# EAGLE design ControlBoardV1 (EAGLE 9.5.2)
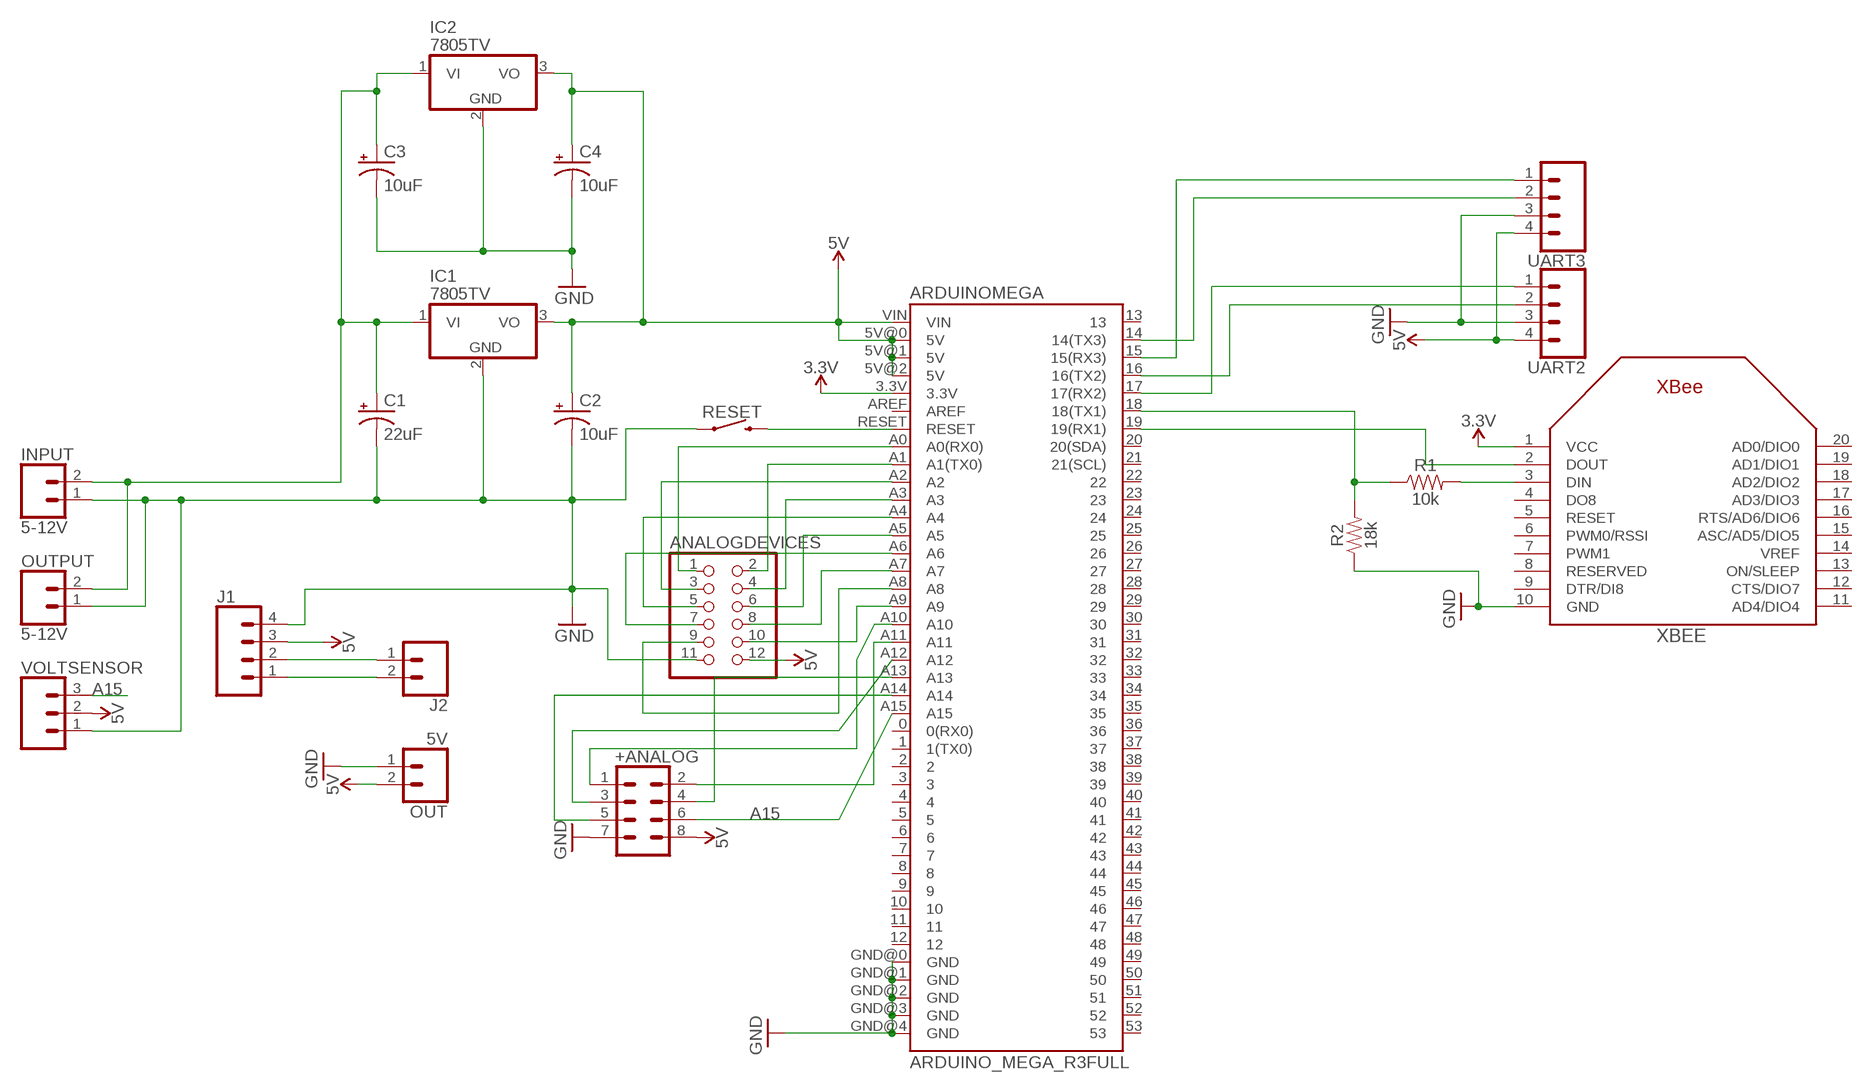
[diagram p0: schematic, sheet 1]

## Parts
+ANALOG  CONN_04X2  [2X4]
ANALOGDEVICES  PINHD-2X6  [2X06]
ARDUINOMEGA  ARDUINO_MEGA_R3FULL  [ARDUINO_MEGA]
C1  22uF  CPOL-USE2.5-5  [E2,5-5]
C2  10uF  CPOL-USE2.5-5  [E2,5-5]
C3  10uF  CPOL-USE2.5-5  [E2,5-5]
C4  10uF  CPOL-USE2.5-5  [E2,5-5]
IC1  7805TV  [TO220V]
IC2  7805TV  [TO220V]
INPUT  5-12V  CONN_023.5MM  [SCREWTERMINAL-3.5MM-2]
J1  CONN_04  [1X04]
J2  CONN_02  [1X02]
OUT  5V  CONN_023.5MM  [SCREWTERMINAL-3.5MM-2]
OUTPUT  5-12V  CONN_023.5MM  [SCREWTERMINAL-3.5MM-2]
R1  10k  10KOHM-HORIZ-1/4W-1%  [AXIAL-0.3]
R2  18k  10KOHM-HORIZ-1/4W-1%  [AXIAL-0.3]
RESET  MOMENTARY-SWITCH-SPST-PTH-6.0MM  [TACTILE_SWITCH_PTH_6.0MM]
UART2  CONN_04  [1X04]
UART3  CONN_04  [1X04]
VOLTSENSOR  CONN_03  [1X03]
XBEE  XBEE  [XBEE]

## Nets
3.3V: ARDUINOMEGA.3.3V XBEE.1(VCC)
5V: +ANALOG.8 ANALOGDEVICES.12 ARDUINOMEGA.5V@0(5V) ARDUINOMEGA.5V@1(5V) ARDUINOMEGA.5V@2(5V) ARDUINOMEGA.VIN C2.+ C4.+ IC1.3(VO) IC2.3(VO) J1.3 OUT.2 UART2.4 UART3.4 VOLTSENSOR.2
A15: +ANALOG.6 ARDUINOMEGA.A15 VOLTSENSOR.3
GND: +ANALOG.7 ANALOGDEVICES.11 ARDUINOMEGA.GND@0(GND) ARDUINOMEGA.GND@1(GND) ARDUINOMEGA.GND@2(GND) ARDUINOMEGA.GND@3(GND) ARDUINOMEGA.GND@4(GND) C1.- C2.- C3.- C4.- IC1.2(GND) IC2.2(GND) INPUT.1 J1.4 OUT.1 OUTPUT.1 R2.P$1 RESET.1 UART2.3 UART3.3 VOLTSENSOR.1 XBEE.10(GND)
N$1: ANALOGDEVICES.1 ARDUINOMEGA.A0(A0(RX0))
N$2: ARDUINOMEGA.19(19(RX1)) XBEE.2(DOUT)
N$3: ARDUINOMEGA.15(15(RX3)) UART3.1
N$4: ARDUINOMEGA.14(14(TX3)) UART3.2
N$5: ARDUINOMEGA.17(17(RX2)) UART2.1
N$6: ARDUINOMEGA.16(16(TX2)) UART2.2
N$7: ARDUINOMEGA.18(18(TX1)) R1.P$1 R2.P$2
N$8: ANALOGDEVICES.2 ARDUINOMEGA.A1(A1(TX0))
N$9: R1.P$2 XBEE.3(DIN)
N$10: ARDUINOMEGA.RESET RESET.3
N$11: C1.+ C3.+ IC1.1(VI) IC2.1(VI) INPUT.2 OUTPUT.2
N$12: ANALOGDEVICES.3 ARDUINOMEGA.A2
N$13: ANALOGDEVICES.5 ARDUINOMEGA.A4
N$14: ANALOGDEVICES.7 ARDUINOMEGA.A6
N$15: ANALOGDEVICES.4 ARDUINOMEGA.A3
N$16: ANALOGDEVICES.6 ARDUINOMEGA.A5
N$17: ANALOGDEVICES.8 ARDUINOMEGA.A7
N$18: ANALOGDEVICES.9 ARDUINOMEGA.A8
N$19: ANALOGDEVICES.10 ARDUINOMEGA.A9
N$20: J1.1 J2.2
N$21: J1.2 J2.1
N$22: +ANALOG.2 ARDUINOMEGA.A11
N$23: +ANALOG.1 ARDUINOMEGA.A10
N$24: +ANALOG.3 ARDUINOMEGA.A12
N$25: +ANALOG.4 ARDUINOMEGA.A13
N$26: +ANALOG.5 ARDUINOMEGA.A14
Unconnected: ARDUINOMEGA.0(0(RX0)) ARDUINOMEGA.1(1(TX0)) ARDUINOMEGA.2 ARDUINOMEGA.3 ARDUINOMEGA.4 ARDUINOMEGA.5 ARDUINOMEGA.6 ARDUINOMEGA.7 ARDUINOMEGA.8 ARDUINOMEGA.9 ARDUINOMEGA.10 ARDUINOMEGA.11 ARDUINOMEGA.12 ARDUINOMEGA.13 ARDUINOMEGA.20(20(SDA)) ARDUINOMEGA.21(21(SCL)) ARDUINOMEGA.22 ARDUINOMEGA.23 ARDUINOMEGA.24 ARDUINOMEGA.25 ARDUINOMEGA.26 ARDUINOMEGA.27 ARDUINOMEGA.28 ARDUINOMEGA.29 ARDUINOMEGA.30 ARDUINOMEGA.31 ARDUINOMEGA.32 ARDUINOMEGA.33 ARDUINOMEGA.34 ARDUINOMEGA.35 ARDUINOMEGA.36 ARDUINOMEGA.37 ARDUINOMEGA.38 ARDUINOMEGA.39 ARDUINOMEGA.40 ARDUINOMEGA.41 ARDUINOMEGA.42 ARDUINOMEGA.43 ARDUINOMEGA.44 ARDUINOMEGA.45 ARDUINOMEGA.46 ARDUINOMEGA.47 ARDUINOMEGA.48 ARDUINOMEGA.49 ARDUINOMEGA.50 ARDUINOMEGA.51 ARDUINOMEGA.52 ARDUINOMEGA.53 ARDUINOMEGA.AREF XBEE.4(DO8) XBEE.5(RESET) XBEE.6(PWM0/RSSI) XBEE.7(PWM1) XBEE.8(RESERVED) XBEE.9(DTR/DI8) XBEE.11(AD4/DIO4) XBEE.12(CTS/DIO7) XBEE.13(ON/SLEEP) XBEE.14(VREF) XBEE.15(ASC/AD5/DIO5) XBEE.16(RTS/AD6/DIO6) XBEE.17(AD3/DIO3) XBEE.18(AD2/DIO2) XBEE.19(AD1/DIO1) XBEE.20(AD0/DIO0)

## Library data of the parts
+ANALOG = SparkFun-Connectors:CONN_04X2: Multi connection point. Often used as Generic Header-pin footprint for 0.1 inch spaced/style header connections On any of the 0.1 inch spaced packages, you can populate with these: Break Away Headers - Straight <https://www.sparkfun.com/products/116> (PRT-00116) Break Away Male Headers - Right Angle <https://www.sparkfun.com/products/553> (PRT-00553) Female Headers <https://www.sparkfun.com/products/115> (PRT-00115) Break Away Headers - Machine Pin <https://www.sparkfun.com/products/117> (PRT-00117) Break Away Female Headers - Swiss Machine Pin <https://www.sparkfun.com/products/743> (PRT-00743)
ANALOGDEVICES = pinhead:PINHD-2X6: PIN HEADER
ARDUINOMEGA = SparkFun-Boards:ARDUINO_MEGA_R3: Arduino Mega R3 ATmega2560 R3 compatible footprint. SparkFun Products: Arduino Mega 2560 R3 <https://www.sparkfun.com/products/11061>
C1-C4 = adafruit:CPOL-US: POLARIZED CAPACITOR, American symbol
IC1 IC2 = linear:78*: Positive VOLTAGE REGULATOR Source: http://cache.national.com/ds/LM/LM78L05.pdf http://www.fairchildsemi.com/ds/LM/LM7805.pdf
INPUT OUT OUTPUT = SparkFun-Connectors:CONN_02: Multi connection point. Often used as Generic Header-pin footprint for 0.1 inch spaced/style header connections On any of the 0.1 inch spaced packages, you can populate with these: Break Away Headers - Straight <https://www.sparkfun.com/products/116> (PRT-00116) Break Away Male Headers - Right Angle <https://www.sparkfun.com/products/553> (PRT-00553) Female Headers <https://www.sparkfun.com/products/115> (PRT-00115) Break Away Headers - Machine Pin <https://www.sparkfun.com/products/117> (PRT-00117) Break Away Female Headers - Swiss Machine Pin <https://www.sparkfun.com/products/743> (PRT-00743) For SCREWTERMINALS and SPRING TERMINALS visit here: Screw Terimnals on SparkFun.com <https://www.sparkfun.com/search/results?term=Screw+Terminals> (5mm/3.5mm/2.54mm spacing) This device is also useful as a general connection point to wire up your design to another part of your project. Our various solder wires solder well into these plated through hole pads. Hook-Up Wire - Assortment (Stranded, 22 AWG) <https://www.sparkfun.com/products/11375> (PRT-11375) Hook-Up Wire - Assortment (Solid Core, 22 AWG) <https://www.sparkfun.com/products/11367> (PRT-11367) View the entire wire category on our website here <https://www.sparkfun.com/categories/141> Special notes: Molex polarized connector foot print use with: PRT-08233 with associated crimp pins and housings. 2.54_SCREWTERM for use with PRT-10571. 3.5mm Screw Terminal footprints for PRT-08084 5mm Screw Terminal footprints for use with PRT-08432; PROD_ID: CONN-08399
J1 UART2 UART3 = SparkFun-Connectors:CONN_04: Multi connection point. Often used as Generic Header-pin footprint for 0.1 inch spaced/style header connections On any of the 0.1 inch spaced packages, you can populate with these: Break Away Headers - Straight <https://www.sparkfun.com/products/116> (PRT-00116) Break Away Male Headers - Right Angle <https://www.sparkfun.com/products/553> (PRT-00553) Female Headers <https://www.sparkfun.com/products/115> (PRT-00115) Break Away Headers - Machine Pin <https://www.sparkfun.com/products/117> (PRT-00117) Break Away Female Headers - Swiss Machine Pin <https://www.sparkfun.com/products/743> (PRT-00743) For SCREWTERMINALS and SPRING TERMINALS visit here: Screw Terimnals on SparkFun.com <https://www.sparkfun.com/search/results?term=Screw+Terminals> (5mm/3.5mm/2.54mm spacing) This device is also useful as a general connection point to wire up your design to another part of your project. Our various solder wires solder well into these plated through hole pads. Hook-Up Wire - Assortment (Stranded, 22 AWG) <https://www.sparkfun.com/products/11375> (PRT-11375) Hook-Up Wire - Assortment (Solid Core, 22 AWG) <https://www.sparkfun.com/products/11367> (PRT-11367) View the entire wire category on our website here <https://www.sparkfun.com/categories/141> Special notes: Molex polarized connector foot print use with SKU : PRT-08231 with associated crimp pins and housings. 1MM SMD Version SKU: PRT-10208; PROD_ID: CONN-09696
J2 = SparkFun-Connectors:CONN_02: Multi connection point. Often used as Generic Header-pin footprint for 0.1 inch spaced/style header connections On any of the 0.1 inch spaced packages, you can populate with these: Break Away Headers - Straight <https://www.sparkfun.com/products/116> (PRT-00116) Break Away Male Headers - Right Angle <https://www.sparkfun.com/products/553> (PRT-00553) Female Headers <https://www.sparkfun.com/products/115> (PRT-00115) Break Away Headers - Machine Pin <https://www.sparkfun.com/products/117> (PRT-00117) Break Away Female Headers - Swiss Machine Pin <https://www.sparkfun.com/products/743> (PRT-00743) For SCREWTERMINALS and SPRING TERMINALS visit here: Screw Terimnals on SparkFun.com <https://www.sparkfun.com/search/results?term=Screw+Terminals> (5mm/3.5mm/2.54mm spacing) This device is also useful as a general connection point to wire up your design to another part of your project. Our various solder wires solder well into these plated through hole pads. Hook-Up Wire - Assortment (Stranded, 22 AWG) <https://www.sparkfun.com/products/11375> (PRT-11375) Hook-Up Wire - Assortment (Solid Core, 22 AWG) <https://www.sparkfun.com/products/11367> (PRT-11367) View the entire wire category on our website here <https://www.sparkfun.com/categories/141> Special notes: Molex polarized connector foot print use with: PRT-08233 with associated crimp pins and housings. 2.54_SCREWTERM for use with PRT-10571. 3.5mm Screw Terminal footprints for PRT-08084 5mm Screw Terminal footprints for use with PRT-08432
R1 = SparkFun-Resistors:10KOHM: 10kΩ resistor A resistor is a passive two-terminal electrical component that implements electrical resistance as a circuit element. Resistors act to reduce current flow, and, at the same time, act to lower voltage levels within circuits. - Wikipedia; PROD_ID: RES-12183
R2 = SparkFun-Resistors:10KOHM: 10kΩ resistor A resistor is a passive two-terminal electrical component that implements electrical resistance as a circuit element. Resistors act to reduce current flow, and, at the same time, act to lower voltage levels within circuits. - Wikipedia; PROD_ID: RES-12183; VALUE: 10k
RESET = SparkFun-Switches:MOMENTARY-SWITCH-SPST: Momentary Switch (Pushbutton) - SPST Normally-open (NO) SPST momentary switches (buttons, pushbuttons). Variants PTH-12MM - 12mm square, through-hole Momentary Pushbutton Switch - 12mm Square <https://www.sparkfun.com/products/9190> (COM-09190) PTH-6.0MM, PTH-6.0MM-KIT - 6.0mm square, through-hole Mini Pushbutton Switch <https://www.sparkfun.com/products/97> (COM-00097) KIT package intended for soldering kit's - only one side of pads' copper is exposed. PTH-RIGHT-ANGLE-KIT - Right-angle, through-hole Right Angle Tactile Button <https://www.sparkfun.com/products/10791> - Used on SparkFun BigTime Watch Kit <https://www.sparkfun.com/products/11734> SMD-12MM - 12mm square, surface-mount Tactile Button - SMD (12mm) <https://www.sparkfun.com/products/12993> (COM-12993) Used on SparkFun PicoBoard <https://www.sparkfun.com/products/11888> SMD-4.5MM - 4.5mm Square Trackball Switch Used on SparkFun Blackberry Trackballer Breakout <https://www.sparkfun.com/products/13169> SMD-4.6MMX2.8MM - 4.60mm x 2.80mm, surface mount Used on SparkFun SAMD21 Mini Breakout <https://www.sparkfun.com/products/13664> SMD-5.2MM, SMD-5.2-REDUNDANT - 5.2mm square, surface-mount Mini Pushbutton Switch - SMD <https://www.sparkfun.com/products/8720> (COM-08720) Used on Arduino Pro Mini <https://www.sparkfun.com/products/11114> REDUNDANT package connects both switch circuits together SMD-6.0X3.5MM - 6.0 x 3.5mm, surface mount Momentary Reset Switch SMD <https://www.sparkfun.com/products/8229> (COM-08229) SMD-6.2MM-TALL - 6.2mm square, surface mount Tactile Button - SMD (6mm) <https://www.sparkfun.com/products/12992> Used on SparkFun Digital Sandbox <https://www.sparkfun.com/products/12651> SMD-RIGHT-ANGLE - Right-angle, surface mount Used on SparkFun Block for Intel® Edison - Arduino <https://www.sparkfun.com/products/13036>; PROD_ID: SWCH-08441; SF_SKU: COM-00097
VOLTSENSOR = SparkFun-Connectors:CONN_03: Multi connection point. Often used as Generic Header-pin footprint for 0.1 inch spaced/style header connections On any of the 0.1 inch spaced packages, you can populate with these: Break Away Headers - Straight <https://www.sparkfun.com/products/116> (PRT-00116) Break Away Male Headers - Right Angle <https://www.sparkfun.com/products/553> (PRT-00553) Female Headers <https://www.sparkfun.com/products/115> (PRT-00115) Break Away Headers - Machine Pin <https://www.sparkfun.com/products/117> (PRT-00117) Break Away Female Headers - Swiss Machine Pin <https://www.sparkfun.com/products/743> (PRT-00743) Stackable Header - 3 Pin (Female, 0.1") <https://www.sparkfun.com/products/13875> (PRT-13875) For SCREWTERMINALS and SPRING TERMINALS visit here: Screw Terimnals on SparkFun.com <https://www.sparkfun.com/search/results?term=Screw+Terminals> (5mm/3.5mm/2.54mm spacing) This device is also useful as a general connection point to wire up your design to another part of your project. Our various solder wires solder well into these plated through hole pads. Hook-Up Wire - Assortment (Stranded, 22 AWG) <https://www.sparkfun.com/products/11375> (PRT-11375) Hook-Up Wire - Assortment (Solid Core, 22 AWG) <https://www.sparkfun.com/products/11367> (PRT-11367) View the entire wire category on our website here <https://www.sparkfun.com/categories/141> Special notes: Molex polarized connector foot print use with SKU : PRT-08232 with associated crimp pins and housings.
XBEE = adafruit:XBEE

## Board
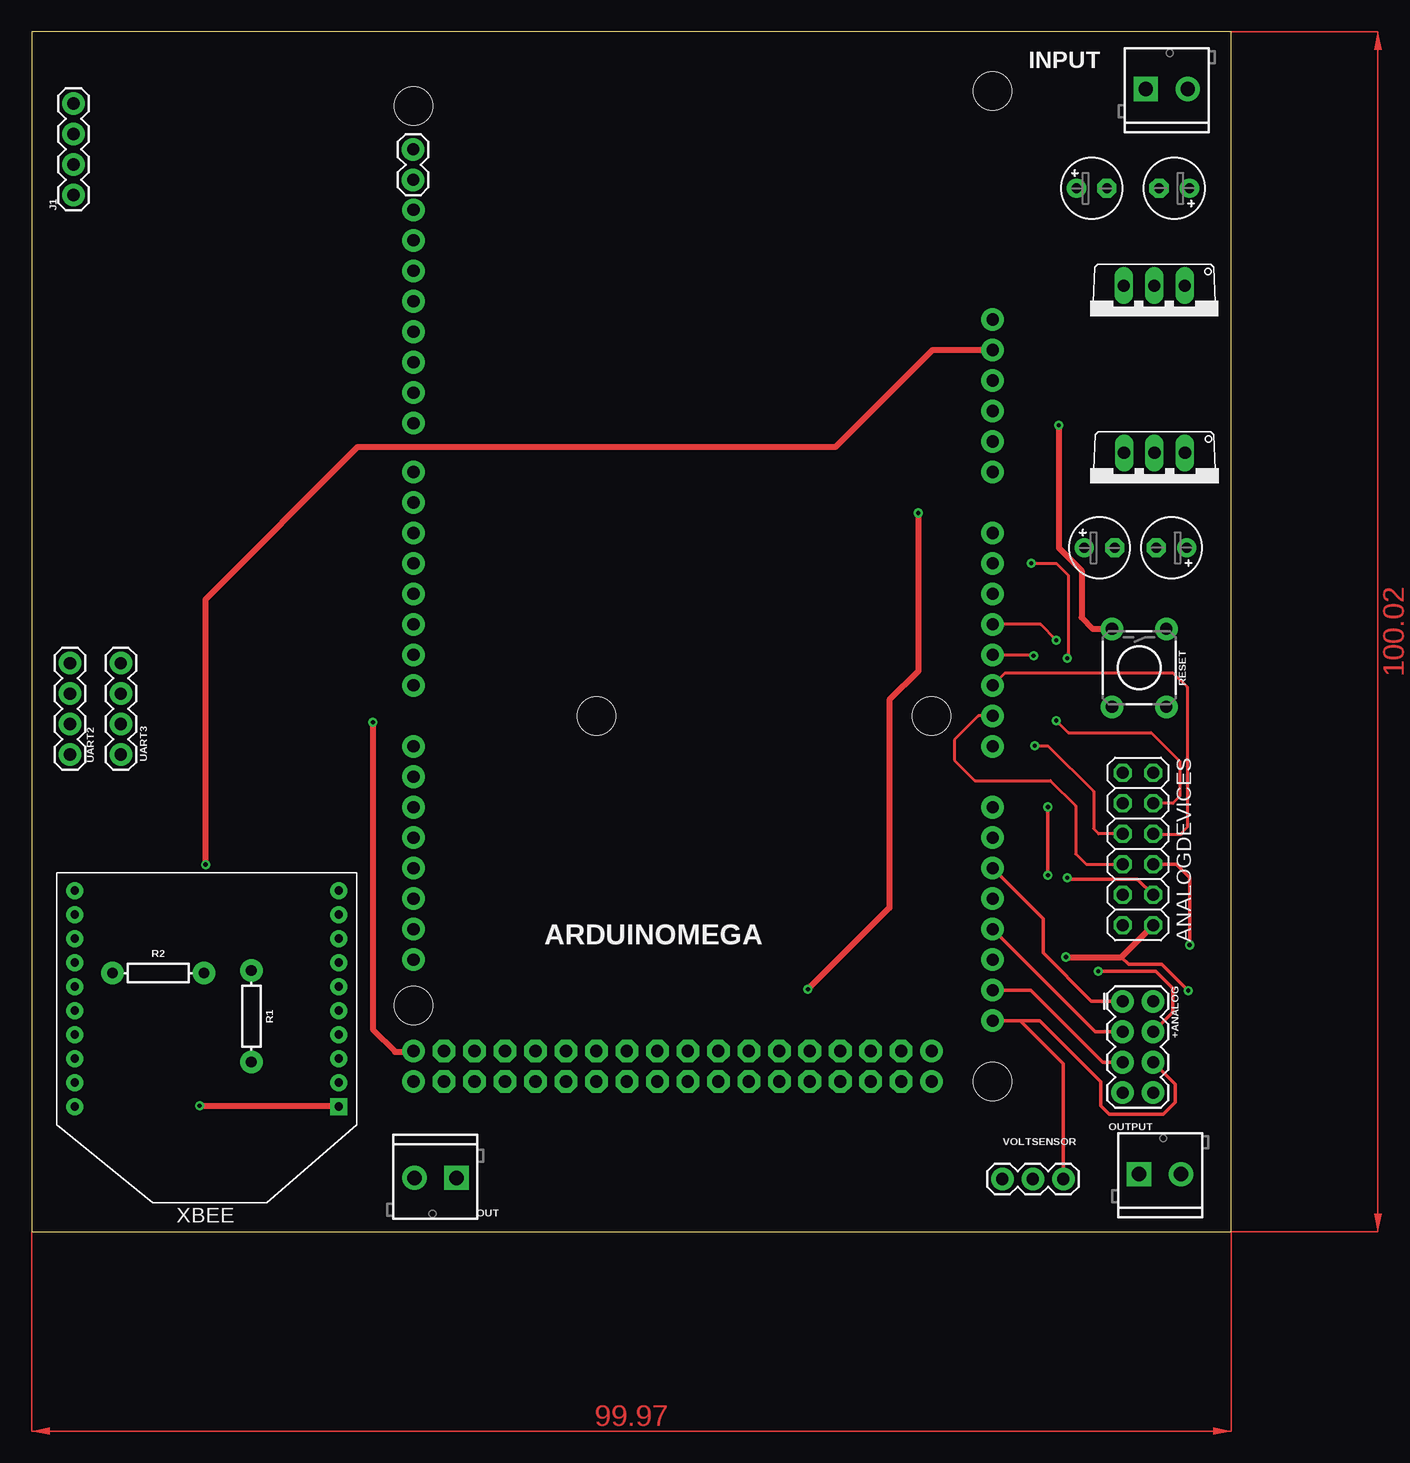
[diagram p1: board, top side]
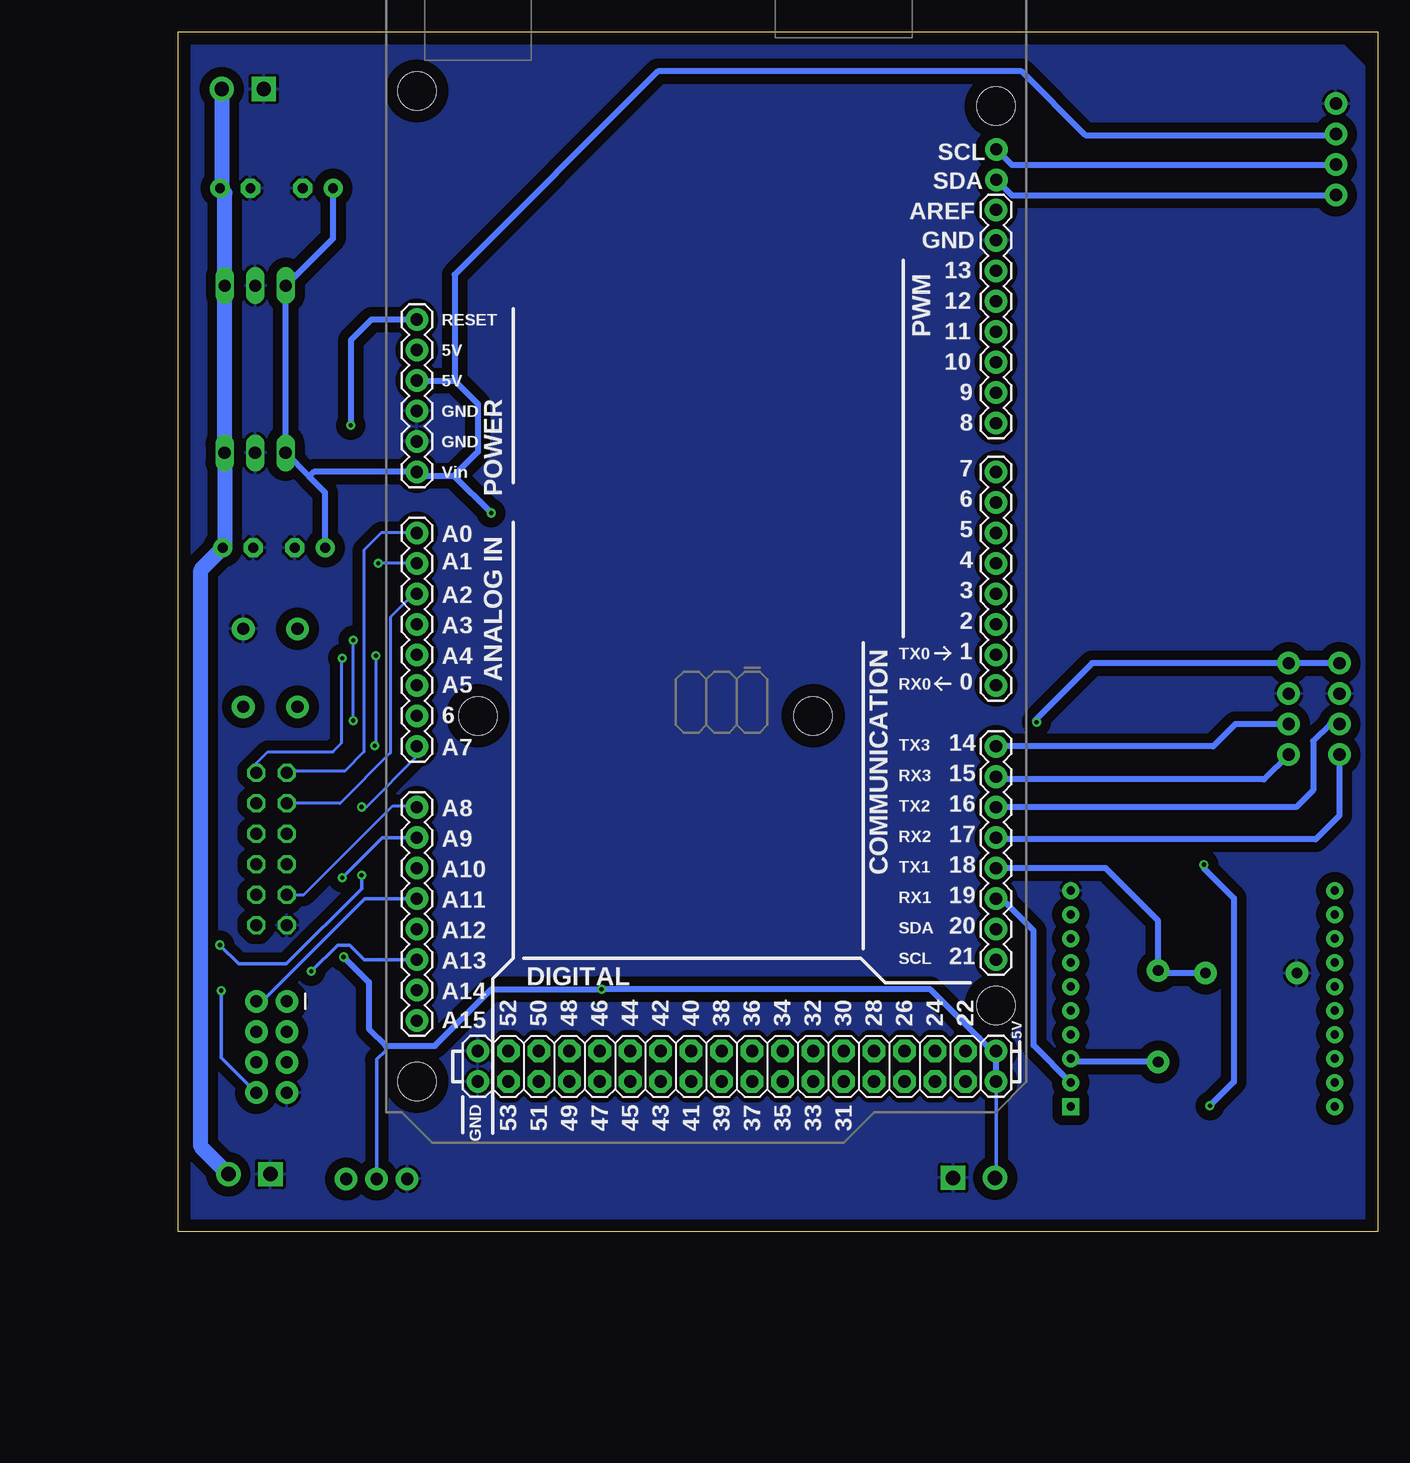
[diagram p2: board, bottom side, seen from below]

Size 99.97 x 100.02 mm. Coordinates in mm from the lower left corner, seen from the top.
Outline: 0,0 99.97,0 99.97,100.02 0,100.02 0,0
Copper layers (1*16): Top 0.035mm / dielectric 1.5mm / Bottom 0.035mm
Design rules "default *": minimum track width 6mil, minimum drill 0.3mm, track to track 6mil, track to pad 6mil, pad to pad 6mil, via to via 6mil, smd to smd 6mil, copper to edge 40mil, drill to drill 6mil, minimum pad ring 10mil, minimum via ring 8mil, stop-mask expansion 4mil, vias tented up to drill 0mil, thermal gap 10mil

### Footprints (pad centres in the part's own frame; a part is rotated, then mirrored left to right if it is on the bottom)
2X4 = drill 1.016 pad 1.88: 1 -3.81,-1.27; 2 -3.81,1.27; 3 -1.27,-1.27; 4 -1.27,1.27; 5 1.27,-1.27; 6 1.27,1.27; 7 3.81,-1.27; 8 3.81,1.27
2X06 = drill 1.016 octagon: 1 -6.35,-1.27; 2 -6.35,1.27; 3 -3.81,-1.27; 4 -3.81,1.27; 5 -1.27,-1.27; 6 -1.27,1.27; 7 1.27,-1.27; 8 1.27,1.27; 9 3.81,-1.27; 10 3.81,1.27; 11 6.35,-1.27; 12 6.35,1.27
ARDUINO_MEGA = drill 1.016 pad 1.88: 0 13.97,24.13; 1 11.43,24.13; 2 8.89,24.13; 3 6.35,24.13; 3.3V -13.97,-24.13; 4 3.81,24.13; 5 1.27,24.13; 5V@0 -11.43,-24.13; 5V@1 44.45,24.13; 5V@2 46.99,24.13; 6 -1.27,24.13; 7 -3.81,24.13; 8 -7.874,24.13; 9 -10.414,24.13; 10 -12.954,24.13; 11 -15.494,24.13; 12 -18.034,24.13; 13 -20.574,24.13; 14 19.05,24.13; 15 21.59,24.13; 16 24.13,24.13; 17 26.67,24.13; 18 29.21,24.13; 19 31.75,24.13; 20 34.29,24.13; 21 36.83,24.13; A0 1.27,-24.13; A1 3.81,-24.13; A2 6.35,-24.13; A3 8.89,-24.13; A4 11.43,-24.13; A5 13.97,-24.13; A6 16.51,-24.13; A7 19.05,-24.13; A8 24.13,-24.13; A9 26.67,-24.13; A10 29.21,-24.13; A11 31.75,-24.13; A12 34.29,-24.13; A13 36.83,-24.13; A14 39.37,-24.13; A15 41.91,-24.13; AREF -25.654,24.13; GND@0 -8.89,-24.13; GND@1 -6.35,-24.13; GND@2 44.45,-19.05; GND@3 46.99,-19.05; GND@4 -23.114,24.13; RESET -16.51,-24.13; VIN -3.81,-24.13 | drill 1.016 pad 1.88 octagon: 22 44.45,21.59; 23 46.99,21.59; 24 44.45,19.05; 25 46.99,19.05; 26 44.45,16.51; 27 46.99,16.51; 28 44.45,13.97; 29 46.99,13.97; 30 44.45,11.43; 31 46.99,11.43; 32 44.45,8.89; 33 46.99,8.89; 34 44.45,6.35; 35 46.99,6.35; 36 44.45,3.81; 37 46.99,3.81; 38 44.45,1.27; 39 46.99,1.27; 40 44.45,-1.27; 41 46.99,-1.27; 42 44.45,-3.81; 43 46.99,-3.81; 44 44.45,-6.35; 45 46.99,-6.35; 46 44.45,-8.89; 47 46.99,-8.89; 48 44.45,-11.43; 49 46.99,-11.43; 50 44.45,-13.97; 51 46.99,-13.97; 52 44.45,-16.51; 53 46.99,-16.51 | hole 3.2: -34.29,24.13; -35.56,-24.13; 16.51,8.89; 16.51,-19.05; 40.64,24.13; 46.99,-24.13
E2,5-5 = drill 0.813 pad 1.6: + -1.27,0 | drill 0.813 pad 1.6 octagon: - 1.27,0
TO220V = drill 1.016 long: 1 -2.54,-2.54; 2 0,-2.54; 3 2.54,-2.54
SCREWTERMINAL-3.5MM-2 = drill 1.2 pad 2.032 square: 1 0,0 | drill 1.2 pad 2.032: 2 3.5,0
1X04 = drill 1.016 pad 1.88: 1 0,0; 2 2.54,0; 3 5.08,0; 4 7.62,0
1X02 = drill 1.016 pad 1.88: 1 0,0; 2 2.54,0
AXIAL-0.3 = drill 0.9 pad 1.88: P$1 -3.81,0; P$2 3.81,0
TACTILE_SWITCH_PTH_6.0MM = drill 1.016 pad 1.88: 1 -3.251,2.261; 2 3.251,2.261; 3 -3.251,-2.261; 4 3.251,-2.261
1X03 = drill 1.016 pad 1.88: 1 0,0; 2 2.54,0; 3 5.08,0
XBEE = drill 0.7 pad 1.422 square: 1 -11,5.5 | drill 0.7 pad 1.422: 2 -11,3.5; 3 -11,1.5; 4 -11,-0.5; 5 -11,-2.5; 6 -11,-4.5; 7 -11,-6.5; 8 -11,-8.5; 9 -11,-10.5; 10 -11,-12.5; 11 11,-12.5; 12 11,-10.5; 13 11,-8.5; 14 11,-6.5; 15 11,-4.5; 16 11,-2.5; 17 11,-0.5; 18 11,1.5; 19 11,3.5; 20 11,5.5

### Placement (x,y rotation side)
+ANALOG  92.2,15.4 270 top
ANALOGDEVICES  92.2,31.9 270 top
ARDUINOMEGA  55.96,59.51 270 bottom
C1  95.23,86.96 180 top
C2  88.34,86.96 0 top
C3  95,57 180 top
C4  89,57 0 top
IC1  93.55,76.31 180 top
IC2  93.58,62.37 180 top
INPUT  92.85,95.23 0 top
J1  3.5,86.4 90 top
J2  31.8,90.2 270 top
OUT  35.4,4.5 180 top
OUTPUT  92.3,4.8 0 top
R1  18.32,17.96 270 top
R2  10.56,21.56 0 top
RESET  92.3,47 270 top
UART2  3.21,39.77 90 top
UART3  7.44,39.77 90 top
VOLTSENSOR  80.9,4.4 0 top
XBEE  14.6,15.93 180 top

### Tracks (layer width: path | path; a pad name or v marks a point on that pad's centre or on a via)
3.3V  (via drill 0.35)
  Top 0.508: v14.5,30.6 14.5,52.7 27.2,65.4 67,65.4 75.1,73.5 80.07,73.5 ARDUINOMEGA.3.3V | v14,10.5 25.53,10.5 XBEE.1
  Bottom 0.508: v14.5,30.6 14.5,30.3 12,27.8 12,12.5 v14,10.5
5V  (via drill 0.35)
  Top 0.305: v96.4,20.1 94.2,22.3 91.42,22.3 90.82,22.9
  Top 0.508: v28.45,42.45 28.45,16.85 30.3,15 31.77,15 ARDUINOMEGA.5V@1 | v73.9,59.9 73.9,46.73 71.49,44.33 71.49,26.99 v64.7,20.2 | ANALOGDEVICES.12 90.82,22.9 v86.2,22.9
  Bottom 0.305: ARDUINOMEGA.5V@2 31.83,4.57 OUT.2 | v96.4,20.1 96.4,14.52 +ANALOG.8 | 82.7,15.5 82.7,15.1 83.44,14.36 VOLTSENSOR.2
  Bottom 0.508: C4.+ 87.73,61.6 89.06,62.94 | 89.06,62.94 IC2.3 91.04,78.82 IC1.3 87.07,82.79 C2.+ | 89.06,62.94 88.68,63.32 ARDUINOMEGA.VIN 79.77,63 77,63 | ARDUINOMEGA.5V@0 76.94,70.94 | 76.94,70.94 75,69 75,65 77,63 | UART2.4 UART3.4 23.81,47.39 28.6,42.6 v28.45,42.45 | ARDUINOMEGA.5V@2 ARDUINOMEGA.5V@1 32.13,15.06 33.22,16.15 33.26,16.15 37.3,20.2 v64.7,20.2 73.9,20.2 78.6,15.5 82.7,15.5 84.1,16.9 84.1,20.8 v86.2,22.9 | 77,63 v73.9,59.9 | J1.3 3.6,91.38 24.38,91.38 29.7,96.7 60,96.7 76.94,79.76 76.94,70.94
A15
  Top 0.305: +ANALOG.6 95.3,12.3 95.3,10.8 94.3,9.8 89.8,9.8 89.1,10.5 89.1,12.5 84,17.6 ARDUINOMEGA.A15 82.4,17.6 85.98,14.02 VOLTSENSOR.3
GND
  pour Bottom (isolate 0.813): 3.2,99.5 3.2,99.2 0.4,96.4 0.4,0.1 99.7,0.1 99.7,99.5
N$1
  Bottom 0.254: ARDUINOMEGA.A0 83.06,58.24 84.5,56.8 84.5,40 86.1,38.4 90.78,38.4 ANALOGDEVICES.1
N$2
  Bottom 0.508: XBEE.2 28.7,15.53 28.7,25.1 31.36,27.76 ARDUINOMEGA.19
N$3
  Bottom 0.508: UART3.1 9.51,37.7 31.61,37.7 ARDUINOMEGA.15
N$4
  Bottom 0.508: UART3.2 11.89,42.31 13.74,40.46 ARDUINOMEGA.14
N$5
  Bottom 0.508: UART2.1 3.21,34.69 5.2,32.7 31.69,32.7 ARDUINOMEGA.17
N$6
  Bottom 0.508: UART2.2 3.99,42.31 5.4,40.9 5.4,36.8 6.82,35.38 ARDUINOMEGA.16
N$7
  Bottom 0.508: ARDUINOMEGA.18 22.7,30.3 18.32,25.92 R1.P$1 18.11,21.56 R2.P$2
N$8  (via drill 0.35)
  Top 0.254: v83.3,55.7 85.4,55.7 86.4,54.7 86.4,47.9 v86.3,47.8
  Bottom 0.254: ANALOGDEVICES.2 93.47,39.03 92.5,40 87.1,40 86.4,40.7 86.4,47.7 v86.3,47.8 | ARDUINOMEGA.A1 v83.3,55.7
N$9
  Bottom 0.508: R1.P$2 25.32,14.15 XBEE.3
N$10  (via drill 0.35)
  Top 0.508: RESET.3 88.45,50.25 87.5,51.2 87.5,55.1 85.6,57 v85.6,67.2
  Bottom 0.508: ARDUINOMEGA.RESET 83.88,76.02 85.6,74.3 v85.6,67.2
N$11
  Bottom 0.508: 96.12,78.82 IC1.1 | 96.09,86.55 96.35,86.81 C1.+ | 96.12,57.15 C3.+
  Bottom 1.27: 96.12,78.82 IC2.1 96.12,57.15 98.1,55.17 98.1,7.1 OUTPUT.2 | IC1.1 96.09,86.55 | INPUT.2 96.35,86.81
N$12
  Bottom 0.254: ARDUINOMEGA.A2 80.34,53.16 82.3,51.2 82.3,39.9 86.49,35.71 ANALOGDEVICES.3
N$13  (via drill 0.35)
  Top 0.254: ANALOGDEVICES.5 88.93,33.17 88.5,33.6 88.5,36.7 84.7,40.5 v83.6,40.5 | ARDUINOMEGA.A4 83.42,48.08 v83.5,48
  Bottom 0.254: v83.5,48 83.5,40.6 v83.6,40.5
N$14
  Top 0.254: ARDUINOMEGA.A6 78.9,43 76.9,41 76.9,39.3 78.6,37.6 84.9,37.6 87,35.5 87,31.5 87.87,30.63 ANALOGDEVICES.7
N$15  (via drill 0.35)
  Top 0.254: v85.4,42.6 86.4,41.6 93.3,41.6 95.7,39.2 95.7,36.3 95.1,35.7 ANALOGDEVICES.4 | v85.4,49.3 84.08,50.62 ARDUINOMEGA.A3
  Bottom 0.254: v85.4,42.6 v85.4,49.3
N$16
  Top 0.254: ARDUINOMEGA.A5 81.09,46.54 95.16,46.54 96.3,45.4 96.3,33.7 95.8,33.2 95.8,33.1 93.54,33.1 ANALOGDEVICES.6
N$17  (via drill 0.35)
  Top 0.305: ANALOGDEVICES.8 95.37,30.63 96.5,29.5 v96.5,23.9 | v84.7,29.7 v84.7,35.4
  Bottom 0.254: ARDUINOMEGA.A7 80.09,39.61 84.3,35.4 v84.7,35.4
  Bottom 0.305: v84.7,29.7 84.7,28.6 90.98,22.32 94.92,22.32 v96.5,23.9
N$18
  Bottom 0.254: ANALOGDEVICES.9 89.51,28.09 82.1,35.5 80.21,35.5 ARDUINOMEGA.A8
N$19  (via drill 0.35)
  Top 0.305: ANALOGDEVICES.10 92.16,29.4 86.4,29.4 v86.3,29.5
  Bottom 0.305: ARDUINOMEGA.A9 82.96,32.84 v86.3,29.5
N$20
  Bottom 0.508: J2.2 30.5,86.36 3.54,86.36 J1.1
N$21
  Bottom 0.508: J2.1 30.5,88.9 3.54,88.9 J1.2
N$22
  Bottom 0.305: ARDUINOMEGA.A11 84.44,27.76 92.99,19.21 +ANALOG.2
N$23
  Top 0.305: ARDUINOMEGA.A10 84.3,26.09 84.3,23.23 88.32,19.21 +ANALOG.1
N$24
  Top 0.305: ARDUINOMEGA.A12 88.64,16.67 +ANALOG.3
N$25  (via drill 0.35)
  Top 0.305: v88.9,21.7 93.7,21.7 95.1,20.3 95.1,18.3 +ANALOG.4
  Bottom 0.305: ARDUINOMEGA.A13 84.48,22.68 85.7,23.9 86.7,23.9 v88.9,21.7
N$26
  Top 0.305: +ANALOG.5 89.27,14.13 83.26,20.14 ARDUINOMEGA.A14
(copper drawn outside any net)
  shapes: Top area x2

### Text on the board
bNames: SCL | SDA